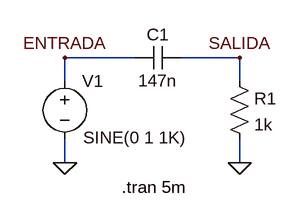
[diagram p0: schematic filtro-paso-alto2.asc]
filtro-paso-alto2.asc, the LTspice schematic file:
Version 4
SHEET 1 880 680
WIRE 144 96 48 96
WIRE 288 96 208 96
WIRE 48 128 48 96
WIRE 288 128 288 96
WIRE 48 240 48 208
WIRE 288 240 288 208
FLAG 288 240 0
FLAG 48 240 0
FLAG 288 96 SALIDA
FLAG 48 96 ENTRADA
SYMBOL voltage 48 112 R0
WINDOW 123 -105 60 Left 2
WINDOW 39 0 0 Left 0
WINDOW 3 25 94 Left 2
SYMATTR Value SINE(0 1 1K)
SYMATTR InstName V1
SYMBOL res 272 112 R0
SYMATTR InstName R1
SYMATTR Value 1k
SYMBOL cap 144 112 R270
WINDOW 0 32 32 VTop 2
WINDOW 3 0 32 VBottom 2
SYMATTR InstName C1
SYMATTR Value 147n
TEXT 126 274 Left 2 !.tran 5m

The netlist it stands for:
* filtro-paso-alto2.asc
V1 ENTRADA 0 SINE(0 1 1K)
R1 SALIDA 0 1k
C1 ENTRADA SALIDA 147n
.tran 5m
.backanno
.end